# Altium schematic sheet BottomSide.SchDoc
size Letter; DrawnBy: Adam Gilbert; Organization: Altium Limited; Address1: L3, 12a Rodborough Rd; Address2: Frenchs Forest; Address3: NSW; Address4: Australia 2086; DocumentNumber: 3; SheetNumber: 3; SheetTotal: 4
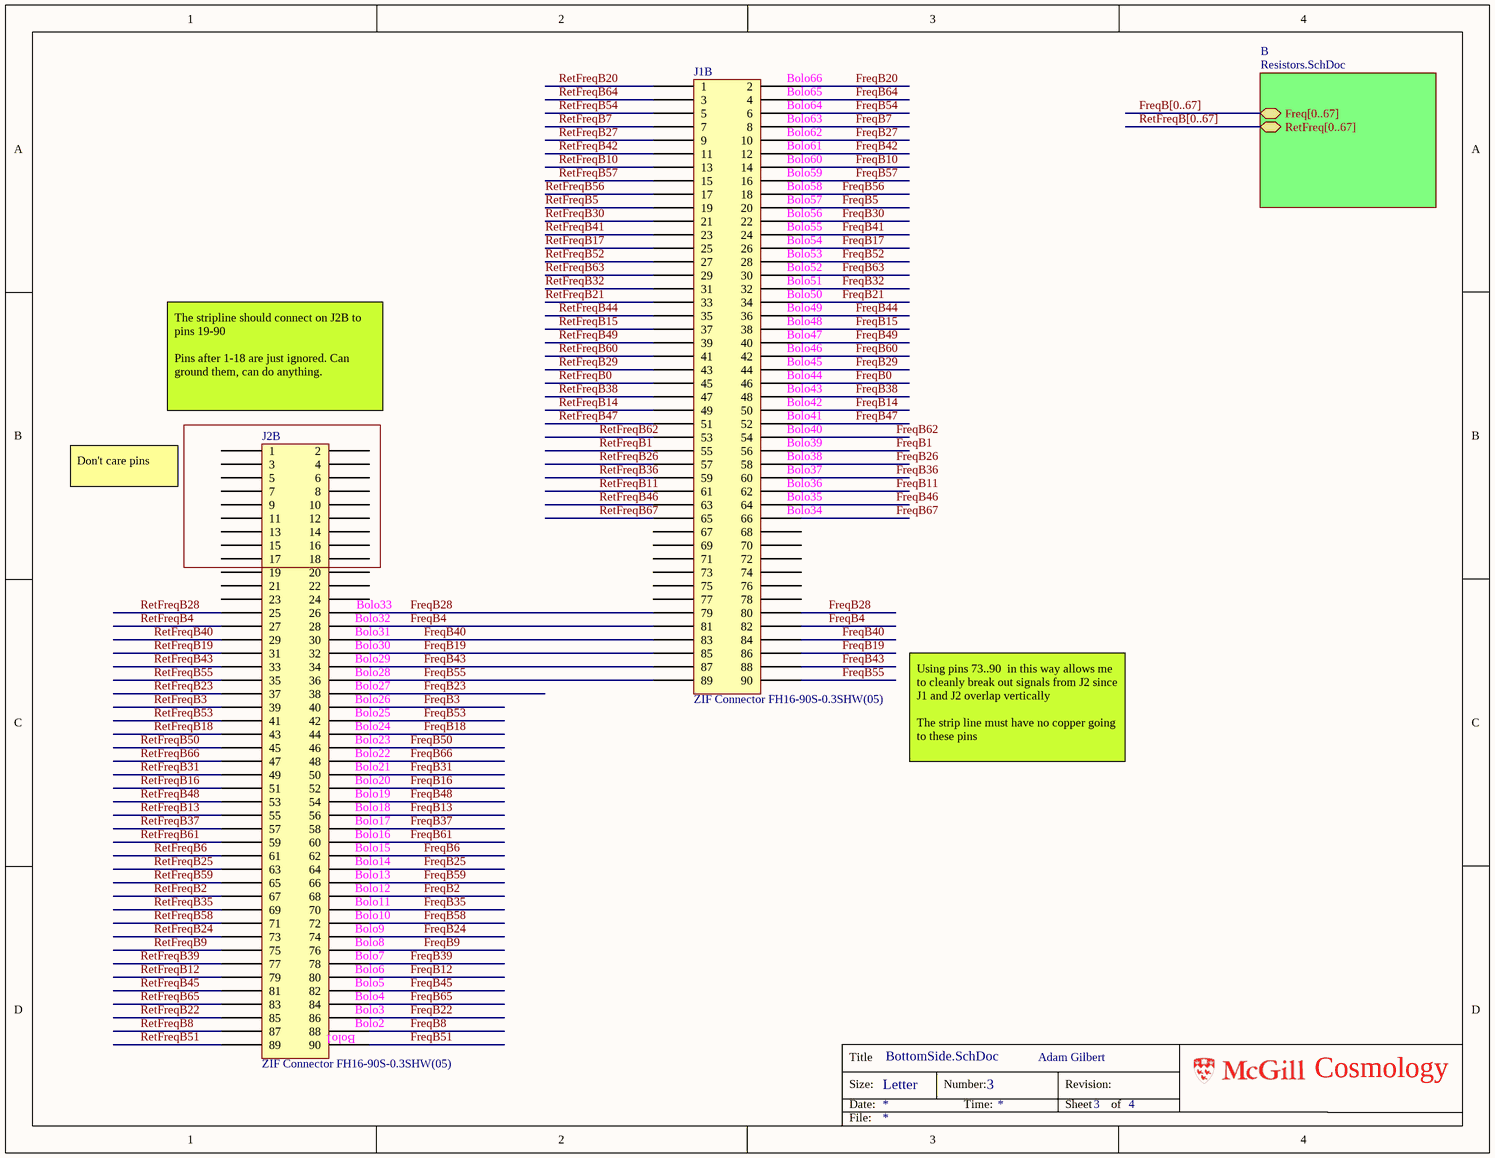
[diagram p0: BottomSide.SchDoc]

## Parts
J1B  ZIF Connector FH16-90S-0.3SHW(05)  [LCBoard_ZIFCon]
J2B  ZIF Connector FH16-90S-0.3SHW(05)  [LCBoard_ZIFCon]

## Sub-sheets
B = Resistors.SchDoc: Freq[0..67], RetFreq[0..67]

## Nets
FreqB0: J1B.46
FreqB1: J1B.56
FreqB2: J2B.68
FreqB3: J2B.40
FreqB4: J1B.81 J1B.82 J2B.28
FreqB5: J1B.20
FreqB6: J2B.62
FreqB7: J1B.8
FreqB8: J2B.88
FreqB9: J2B.76
FreqB10: J1B.14
FreqB11: J1B.62
FreqB12: J2B.80
FreqB13: J2B.56
FreqB14: J1B.50
FreqB15: J1B.38
FreqB16: J2B.52
FreqB17: J1B.26
FreqB18: J2B.44
FreqB19: J1B.85 J1B.86 J2B.32
FreqB20: J1B.2
FreqB21: J1B.34
FreqB22: J2B.86
FreqB23: J2B.38
FreqB24: J2B.74
FreqB25: J2B.64
FreqB26: J1B.58
FreqB27: J1B.10
FreqB28: J1B.79 J1B.80 J2B.26
FreqB29: J1B.44
FreqB30: J1B.22
FreqB31: J2B.50
FreqB32: J1B.32
FreqB35: J2B.70
FreqB36: J1B.60
FreqB37: J2B.58
FreqB38: J1B.48
FreqB39: J2B.78
FreqB40: J1B.83 J1B.84 J2B.30
FreqB41: J1B.24
FreqB42: J1B.12
FreqB43: J1B.87 J1B.88 J2B.34
FreqB44: J1B.36
FreqB45: J2B.82
FreqB46: J1B.64
FreqB47: J1B.52
FreqB48: J2B.54
FreqB49: J1B.40
FreqB50: J2B.46
FreqB51: J2B.90
FreqB52: J1B.28
FreqB53: J2B.42
FreqB54: J1B.6
FreqB55: J1B.89 J1B.90 J2B.36
FreqB56: J1B.18
FreqB57: J1B.16
FreqB58: J2B.72
FreqB59: J2B.66
FreqB60: J1B.42
FreqB61: J2B.60
FreqB62: J1B.54
FreqB63: J1B.30
FreqB64: J1B.4
FreqB65: J2B.84
FreqB66: J2B.48
FreqB67: J1B.66
RetFreqB0: J1B.45
RetFreqB1: J1B.55
RetFreqB2: J2B.67
RetFreqB3: J2B.39
RetFreqB4: J2B.27
RetFreqB5: J1B.19
RetFreqB6: J2B.61
RetFreqB7: J1B.7
RetFreqB8: J2B.87
RetFreqB9: J2B.75
RetFreqB10: J1B.13
RetFreqB11: J1B.61
RetFreqB12: J2B.79
RetFreqB13: J2B.55
RetFreqB14: J1B.49
RetFreqB15: J1B.37
RetFreqB16: J2B.51
RetFreqB17: J1B.25
RetFreqB18: J2B.43
RetFreqB19: J2B.31
RetFreqB20: J1B.1
RetFreqB21: J1B.33
RetFreqB22: J2B.85
RetFreqB23: J2B.37
RetFreqB24: J2B.73
RetFreqB25: J2B.63
RetFreqB26: J1B.57
RetFreqB27: J1B.9
RetFreqB28: J2B.25
RetFreqB29: J1B.43
RetFreqB30: J1B.21
RetFreqB31: J2B.49
RetFreqB32: J1B.31
RetFreqB35: J2B.69
RetFreqB36: J1B.59
RetFreqB37: J2B.57
RetFreqB38: J1B.47
RetFreqB39: J2B.77
RetFreqB40: J2B.29
RetFreqB41: J1B.23
RetFreqB42: J1B.11
RetFreqB43: J2B.33
RetFreqB44: J1B.35
RetFreqB45: J2B.81
RetFreqB46: J1B.63
RetFreqB47: J1B.51
RetFreqB48: J2B.53
RetFreqB49: J1B.39
RetFreqB50: J2B.45
RetFreqB51: J2B.89
RetFreqB52: J1B.27
RetFreqB53: J2B.41
RetFreqB54: J1B.5
RetFreqB55: J2B.35
RetFreqB56: J1B.17
RetFreqB57: J1B.15
RetFreqB58: J2B.71
RetFreqB59: J2B.65
RetFreqB60: J1B.41
RetFreqB61: J2B.59
RetFreqB62: J1B.53
RetFreqB63: J1B.29
RetFreqB64: J1B.3
RetFreqB65: J2B.83
RetFreqB66: J2B.47
RetFreqB67: J1B.65

Not connected (* = marked no-connect by the designer): J1B 67 68 69 70 71 72 73 74 75 76 77 78; J2B 1 2 3 4 5 6 7 8 9 10 11 12 13 14 15 16 17 18 19 20 21 22 23 24

## Buses and harness runs
bus FreqB[0..67] = sheet B/Freq[0..67]
bus RetFreqB[0..67] = sheet B/RetFreq[0..67]

## Notes on the sheet
- (near J1B) Bolo65
- (near J1B) Bolo66
- (near J1B) Bolo60
- (near J1B) Bolo61
- (near J1B) Bolo62
- (near J1B) Bolo63
- (near J1B) Bolo64
- (near J1B) Bolo55
- (near J1B) Bolo56
- (near J1B) Bolo57
- (near J1B) Bolo58
- (near J1B) Bolo59
- (near J1B) Bolo50
- (near J1B) Bolo51
- (near J1B) Bolo52
- (near J1B) Bolo53
- (near J1B) Bolo54
- (near J1B) Bolo45
- (near J1B) Bolo46
- (near J1B) Bolo47
- (near J1B) Bolo48
- (near J1B) Bolo49
- (near J2B) The stripline should connect on J2B to pins 19-90
  Pins after 1-18 are just ignored. Can ground them, can do anything.
- (near J1B) Bolo40
- (near J1B) Bolo41
- (near J1B) Bolo42
- (near J1B) Bolo43
- (near J1B) Bolo44
- Don't care pins
- (near J1B) Bolo35
- (near J1B) Bolo36
- (near J1B) Bolo37
- (near J1B) Bolo38
- (near J1B) Bolo39
- (near J1B) Bolo34
- (near J2B) Bolo31
- (near J2B) Bolo32
- (near J2B) Bolo33
- (near J2B) Bolo26
- (near J2B) Bolo27
- (near J2B) Bolo28
- (near J2B) Bolo29
- (near J2B) Bolo30
- (near J2B) Bolo21
- (near J2B) Bolo22
- (near J2B) Bolo23
- (near J2B) Bolo24
- (near J2B) Bolo25
- Using pins 73..90  in this way allows me to cleanly break out signals from J2 since J1 and J2 overlap vertically
  The strip line must have no copper going to these pins
- (near J2B) Bolo16
- (near J2B) Bolo17
- (near J2B) Bolo18
- (near J2B) Bolo19
- (near J2B) Bolo20
- (near J2B) Bolo11
- (near J2B) Bolo12
- (near J2B) Bolo13
- (near J2B) Bolo14
- (near J2B) Bolo15
- (near J2B) Bolo6
- (near J2B) Bolo7
- (near J2B) Bolo8
- (near J2B) Bolo9
- (near J2B) Bolo10
- (near J2B) Bolo2
- (near J2B) Bolo3
- (near J2B) Bolo4
- (near J2B) Bolo5
- (near J2B) Bolo1
- Title
- Size:
- Date:
- Letter
- Number:
- Time:
- Revision:
- Sheet
- of
- Cosmology
- File:

## Library data of the parts
J1B J2B = LCboard_FH16-90S-0.3SHW(05)